# EAGLE design TSOC_GROVEY_UART (EAGLE 6.6.0)
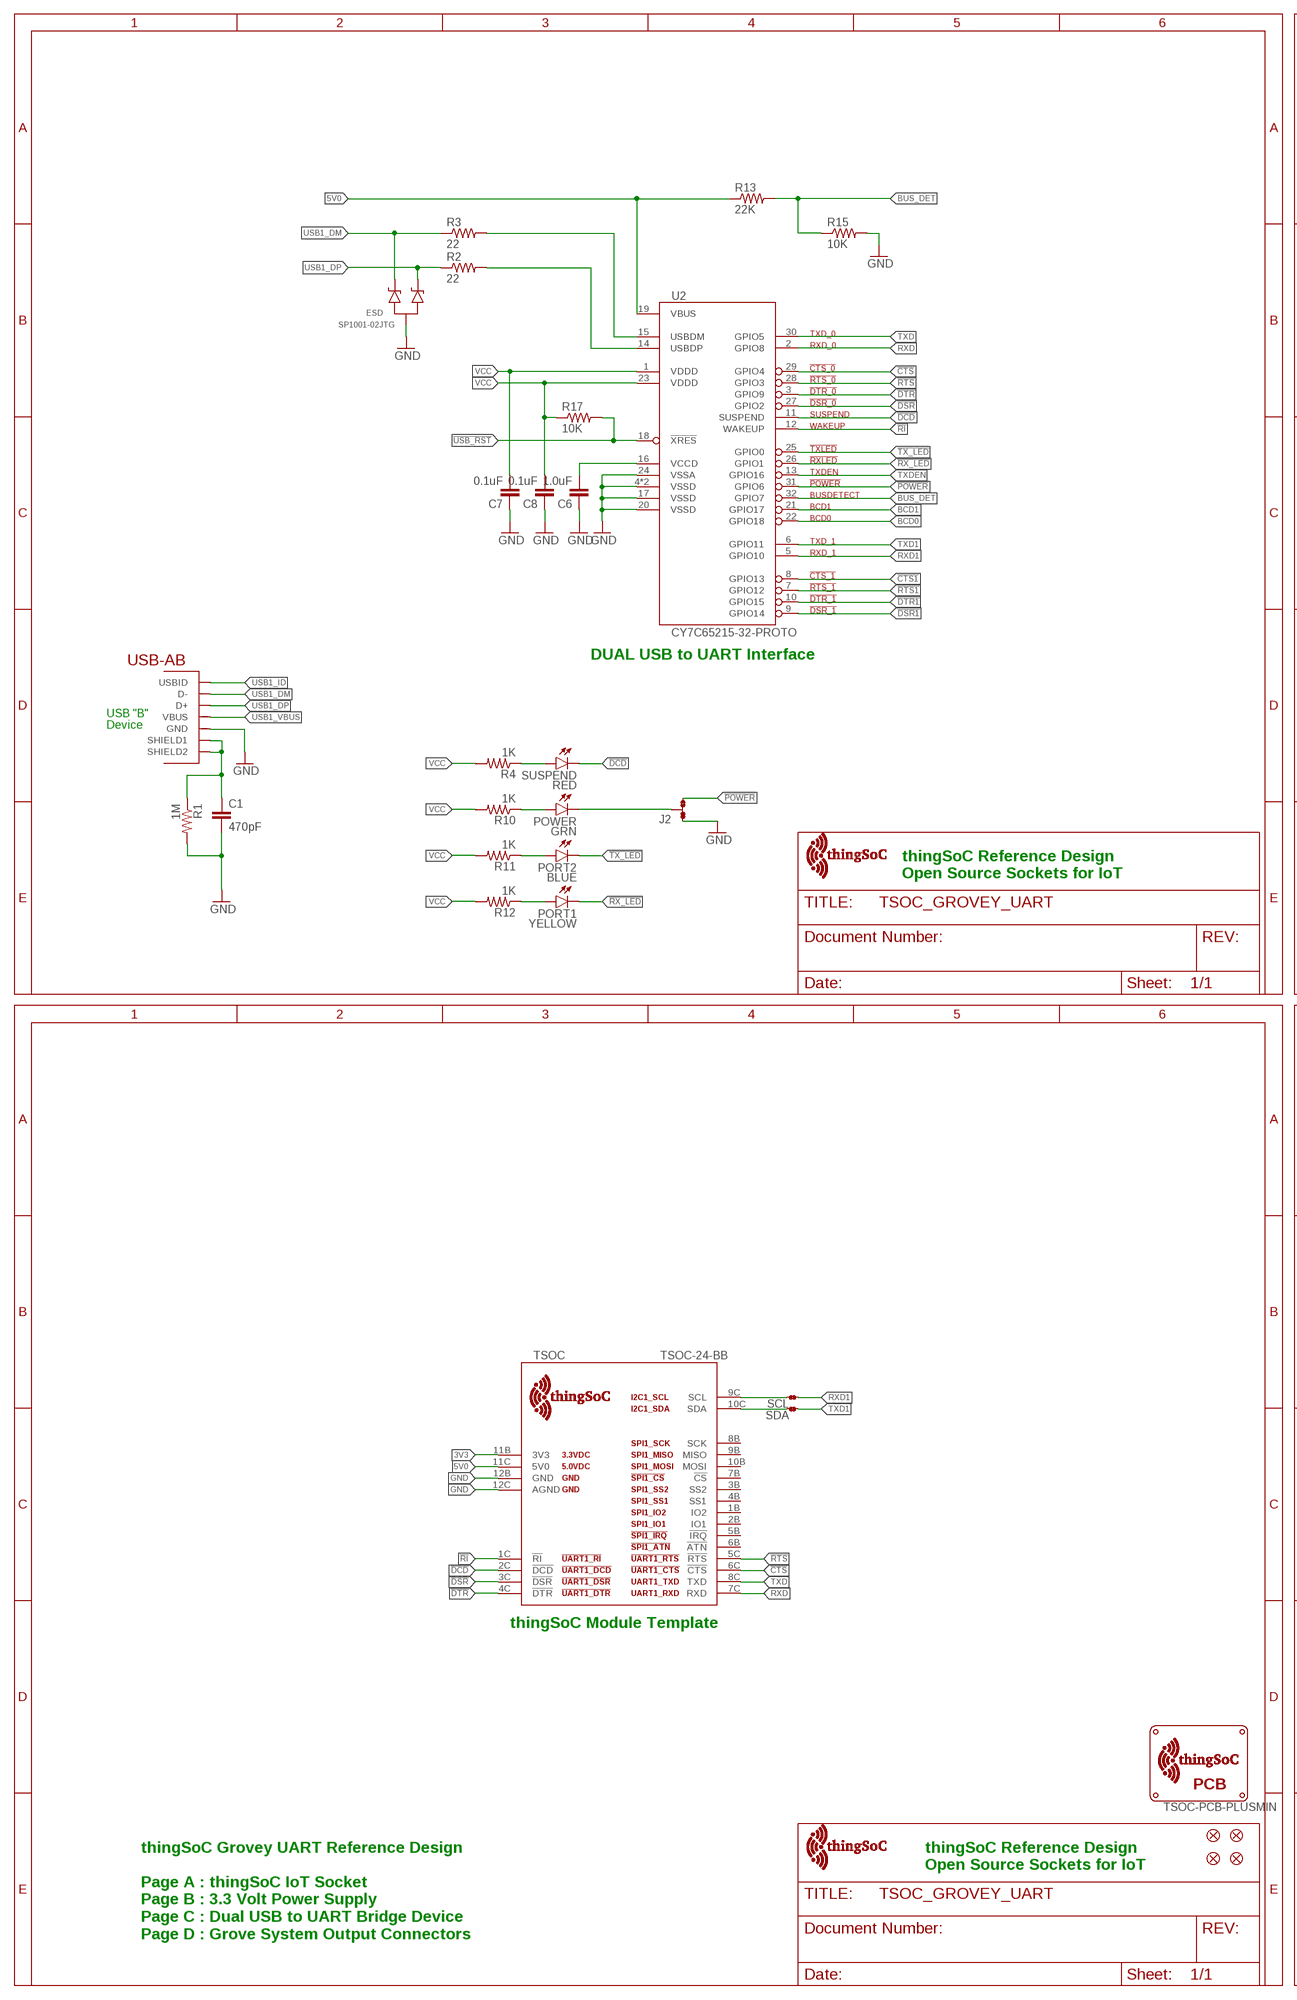
[diagram p0: schematic, sheet 1, part 1 of 2]
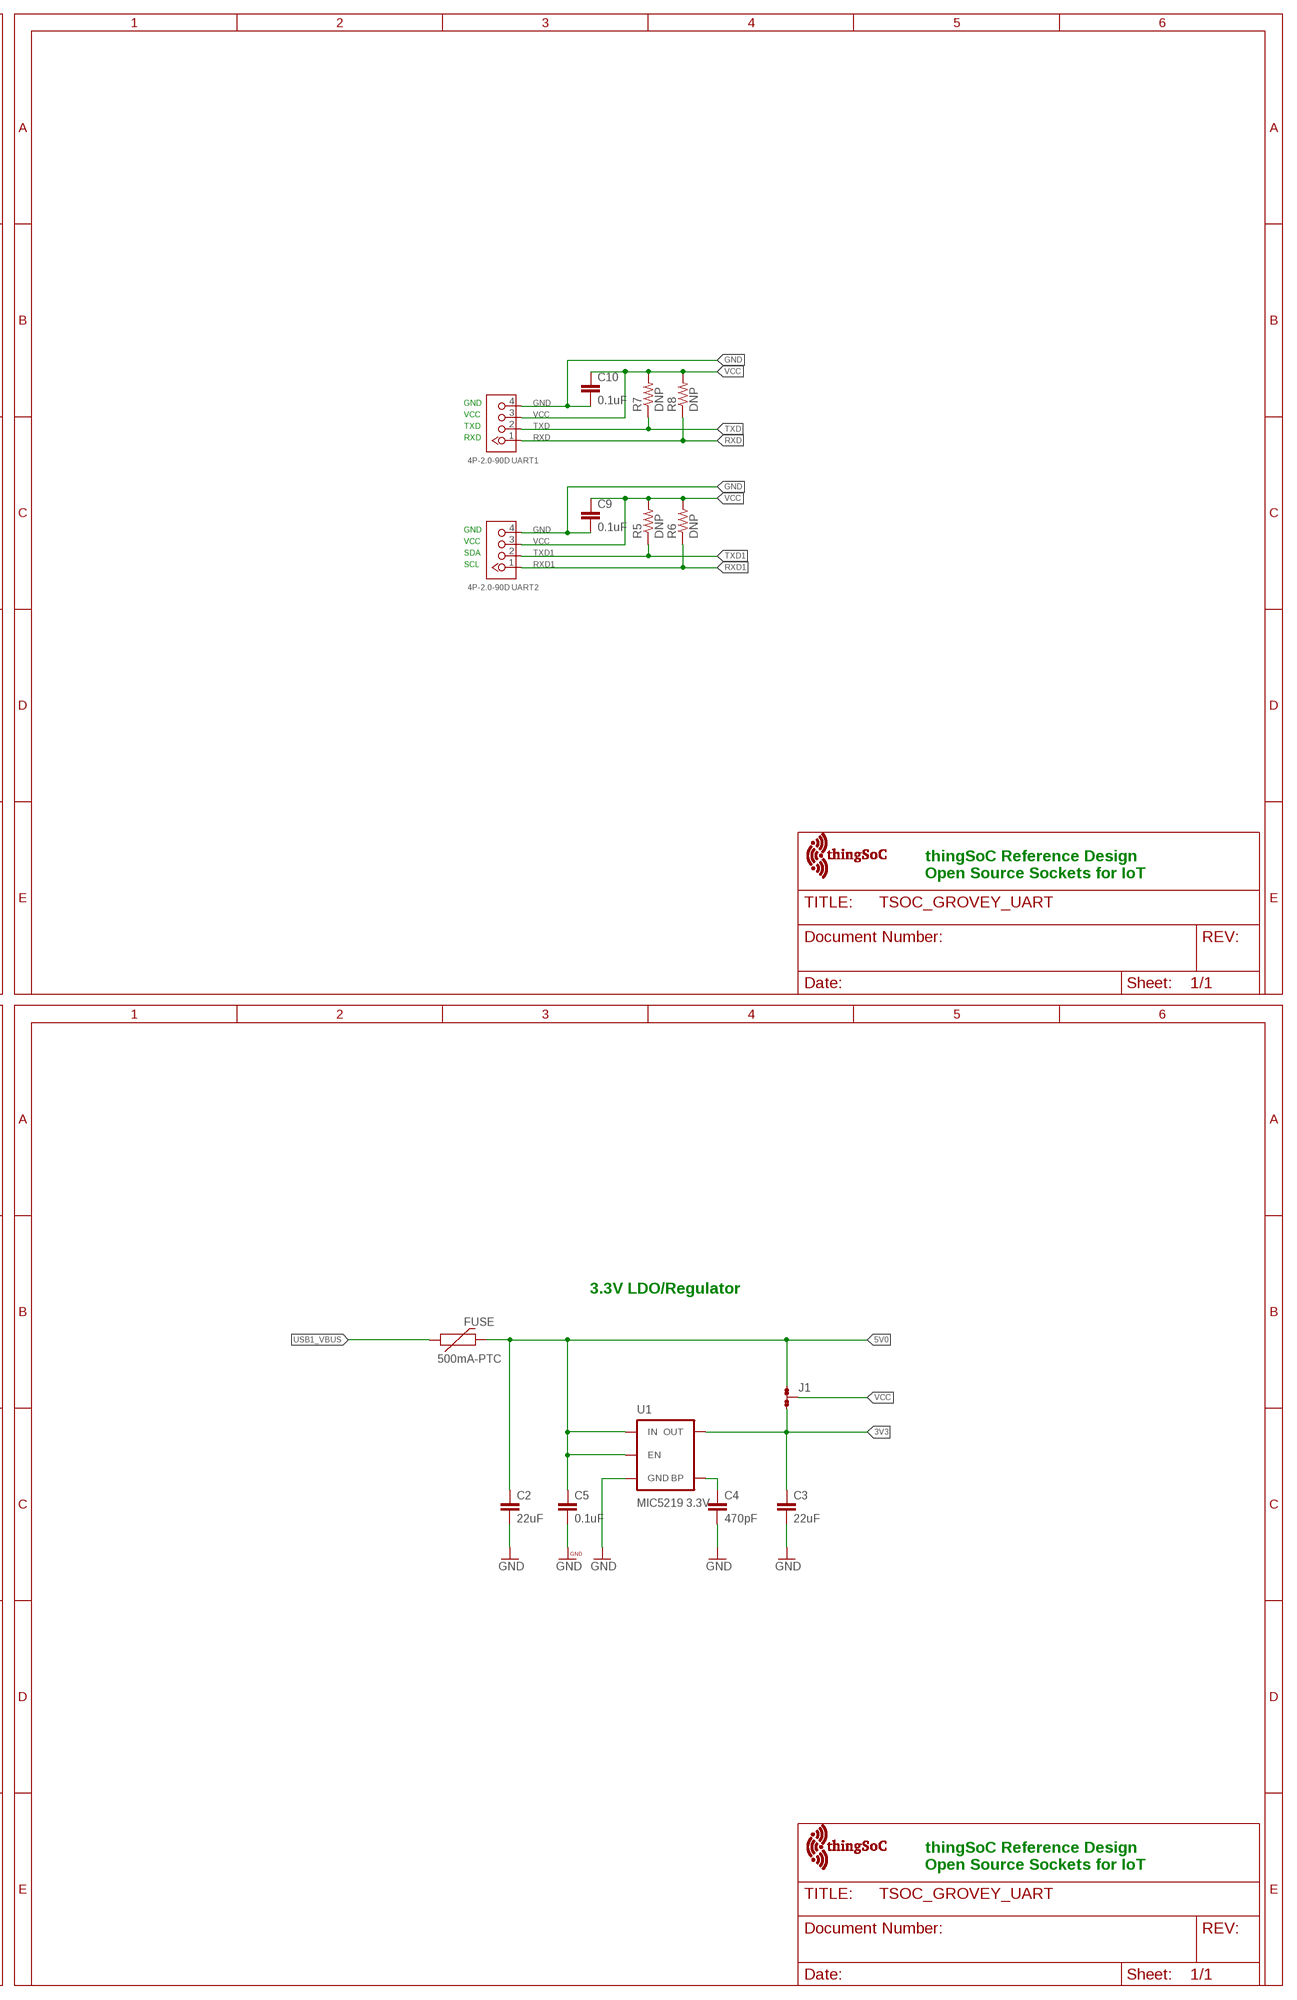
[diagram p1: schematic, sheet 1, part 2 of 2]

## Parts
C1  470pF  CAP-0603  [EIA-0603]
C2  22uF  CAP-1206  [EIA-1206]
C3  22uF  CAP-1206  [EIA-1206]
C4  470pF  CAP-0603  [EIA-0603]
C5  0.1uF  CAP-0603  [EIA-0603]
C6  1.0uF  CAP-0603  [EIA-0603]
C7  0.1uF  CAP-0603  [EIA-0603]
C8  0.1uF  CAP-0603  [EIA-0603]
C9  0.1uF  CAP0603-CAP  [0603-CAP]
C10  0.1uF  CAP0603-CAP  [0603-CAP]
ESD  SP1001-02JTG  [SC70-3]
FID1  FIDUCIALUFIDUCIAL  [MICRO-FIDUCIAL]
FID2  FIDUCIALUFIDUCIAL  [MICRO-FIDUCIAL]
FID3  FIDUCIALUFIDUCIAL  [MICRO-FIDUCIAL]
FID4  FIDUCIALUFIDUCIAL  [MICRO-FIDUCIAL]
FUSE  500mA-PTC  PTCSMD  [PTC-1206]
J1  JMP-3-1_2  [JMP-3-1_2]
J2  JMP-3-1_2  [JMP-3-1_2]
PCB  TSOC-PCB-PLUSMIN  [TSOC-BB-BRD-PLUS-MIN-DIM]
PORT1  YELLOW  LED0603  [LED-0603]
PORT2  BLUE  LED0603  [LED-0603]
POWER  GRN  LED0603  [LED-0603]
R1  1M  RESISTOR-0603  [EIA-0603]
R2  22  RESISTOR-0603  [EIA-0603]
R3  22  RESISTOR-0603  [EIA-0603]
R4  1K  RESISTOR-0603  [EIA-0603]
R5  DNP  RESISTOR0603-RES  [0603-RES]
R6  DNP  RESISTOR0603-RES  [0603-RES]
R7  DNP  RESISTOR0603-RES  [0603-RES]
R8  DNP  RESISTOR0603-RES  [0603-RES]
R10  1K  RESISTOR-0603  [EIA-0603]
R11  1K  RESISTOR-0603  [EIA-0603]
R12  1K  RESISTOR-0603  [EIA-0603]
R13  22K  RESISTOR-0603  [EIA-0603]
R15  10K  RESISTOR-0603  [EIA-0603]
R17  10K  RESISTOR-0603  [EIA-0603]
SCL  JMP-2-NO  [JMP-2-NO]
SDA  JMP-2-NO  [JMP-2-NO]
SUSPEND  RED  LED0603  [LED-0603]
TSOC  TSOC-24-BB  [TSOC-BB-S24]
U1  MIC5219 3.3V  V_REG_MIC52193.3V  [SOT23-5]
U2  CY7C65215-32-PROTO  [QFN32-PROTO]
U$3  TSOC-LOGO-LRG  [TSOC-LOGO-LRG]
U$4  TSOC-LOGO  [TSOC-LOGO-BLANK]
U$5  TSOC-LOGO  [TSOC-LOGO-BLANK]
U$6  TSOC-LOGO  [TSOC-LOGO-BLANK]
UART1  4P-2.0-90D  GROVE-CONNECTOR-DIP-90D(4P-2.0)  [HW4-2.0-90D]
UART2  4P-2.0-90D  GROVE-CONNECTOR-DIP-90D(4P-2.0)  [HW4-2.0-90D]
USB  USB_AB  [USB-AB-MICRO-SMD]

## Nets
3V3: C3.1 J1.3 TSOC.11B(3V3) U1.5(OUT)
5V0: C2.1 C5.1 FUSE.2 J1.1 R13.1 TSOC.11C(5V0) U1.1(IN) U1.3(EN) U2.19(VBUS)
!CTS: TSOC.6C(!CTS) U2.29(GPIO4)
!CTS1: U2.8(GPIO13)
!DCD: SUSPEND.C TSOC.2C(!DCD) U2.11(SUSPEND)
!DSR: TSOC.3C(!DSR) U2.27(GPIO2)
!DSR1: U2.9(GPIO14)
!DTR: TSOC.4C(!DTR) U2.3(GPIO9)
!DTR1: U2.10(GPIO15)
!POWER: J2.3 U2.31(GPIO6)
!RI: TSOC.1C(!RI) U2.12(WAKEUP)
!RTS: TSOC.5C(!RTS) U2.28(GPIO3)
!RTS1: U2.7(GPIO12)
!RX_LED: PORT1.C U2.26(GPIO1)
!TX_LED: PORT2.C U2.25(GPIO0)
!USB_RST: R17.2 U2.18(!XRES)
BCD0: U2.22(GPIO18)
BCD1: U2.21(GPIO17)
BLU: PORT2.A R11.1
BUS_DET: R13.2 R15.1 U2.32(GPIO7)
BYPASS1: C4.1 U1.4(BP)
GND [vcc]: C1.2 C2.2 C3.2 C4.2 C5.2 C6.1 C7.1 C8.1 C9.2 C10.2 ESD.3(A) J2.1 R1.2 R15.2 TSOC.12B(GND) TSOC.12C(AGND) U1.2(GND) U2.4(VSSD) U2.17(VSSD) U2.20(VSSD) U2.24(VSSA) U2.EXP(VSSD) UART1.4 UART2.4 USB.GND
GRN: POWER.A R10.1
PWR: J2.2 POWER.C
RED: R4.1 SUSPEND.A
RXD: R8.1 TSOC.7C(RXD) U2.2(GPIO8) UART1.1
RXD1: R6.1 SCL.1 U2.5(GPIO10) UART2.1
SCL: SCL.2 TSOC.9C(SCL)
SDA: SDA.2 TSOC.10C(SDA)
TXD: R7.1 TSOC.8C(TXD) U2.30(GPIO5) UART1.2
TXD1: R5.1 SDA.1 U2.6(GPIO11) UART2.2
TXDEN: U2.13(GPIO16)
USB1_DM: ESD.2(C2) R3.1 USB.D-
USB1_DP: ESD.1(C1) R2.1 USB.D+
USB1_ID: USB.ID(USBID)
USB1_M: R3.2 U2.15(USBDM)
USB1_P: R2.2 U2.14(USBDP)
USB1_SHIELD: C1.1 R1.1 USB.SHIELD1 USB.SHIELD2
USB1_VBUS: FUSE.1 USB.VBUS
VCC: C7.2 C8.2 C9.1 C10.1 J1.2 R4.2 R5.2 R6.2 R7.2 R8.2 R10.2 R11.2 R12.2 R17.1 U2.1(VDDD) U2.23(VDDD) UART1.3 UART2.3
VCCD1: C6.2 U2.16(VCCD)
YEL: PORT1.A R12.1
Unconnected: TSOC.1B(IO2) TSOC.2B(IO1) TSOC.3B(SS2) TSOC.4B(SS1) TSOC.5B(!IRQ) TSOC.6B(!ATN) TSOC.7B(!CS) TSOC.8B(SCK) TSOC.9B(MISO) TSOC.10B(MOSI)

## Notes on the sheet
- GND
- VCC
- TXD
- RXD
- GND
- VCC
- SDA
- SCL
- DUAL USB to UART Interface
- USB "B"
- Device
- thingSoC Reference Design
  Open Source Sockets for IoT
- thingSoC Reference Design
  Open Source Sockets for IoT
- 3.3V LDO/Regulator
- thingSoC Module Template
- thingSoC Reference Design
  Open Source Sockets for IoT
- thingSoC Reference Design
  Open Source Sockets for IoT
- thingSoC Grovey UART Reference Design
  
  Page A : thingSoC IoT Socket
  Page B : 3.3 Volt Power Supply
  Page C : Dual USB to UART Bridge Device
  Page D : Grove System Output Connectors

## Library data of the parts
C1-C8 = TSOC_USBUART2:CAP: Ceramic Capacitor SMD
C9 C10 = SparkFun-Passives:CAP: Capacitor Standard 0603 ceramic capacitor, and 0.1" leaded capacitor.
ESD = TSOC-ESP8266-BASE:SP1001-02JTG: Littelfuse SP1001-02JTG TVS Diode Array 8pf 15kV Source: http://www.littelfuse.com/data/en/Product_Catalogs/Littelfuse_TVS_Diode_Array_SPA_Catalog.pdf patternshed.com: created 3/25/2012
FID1-FID4 = TSOC-ESP8266-BASE:FIDUCIAL: Fiducial Alignment Points Various fiducial points for machine vision alignment.
FUSE = SparkFun:PTC: Resettable Fuse PTC Resettable Fuse. Spark Fun Electronics SKU : COM-08357
J1 J2 = PatternAgents-ProtoPads:JMP-3-1_2: Three Terminal Jumper - 1 & 2 Connected Positions 1and 2 are normally connected. PatternAgents ProtoPads Library Schematic and PCB layout libraries for design patterns by PatternAgents. For the CADSoft Eagle CAD program : http://www.cadsoftusa.com/download-eagle/ Source LBR : http://www.patternagents.com Github : https://github.com/PatternAgents License : http://creativecommons.org/licenses/by-sa/4.0/ (Creative Commons 4.0) THIS SOFTWARE IS PROVIDED BY THE CONTRIBUTORS "AS IS" AND WITHOUT ANY EXPRESS OR IMPLIED WARRANTIES, INCLUDING, BUT NOT LIMITED TO, THE IMPLIED WARRANTIES OF MERCHANTABILITY AND FITNESS FOR A PARTICULAR PURPOSE ARE DISCLAIMED. IN NO EVENT SHALL THE COPYRIGHT OWNER OR CONTRIBUTORS BE LIABLE FOR ANY DIRECT, INDIRECT, INCIDENTAL, SPECIAL, EXEMPLARY, OR CONSEQUENTIAL DAMAGES (INCLUDING, BUT NOT LIMITED TO, PROCUREMENT OF SUBSTITUTE GOODS OR SERVICES; LOSS OF USE, DATA, OR PROFITS; OR BUSINESS INTERRUPTION) HOWEVER CAUSED AND ON ANY THEORY OF LIABILITY, WHETHER IN CONTRACT, STRICT LIABILITY, OR TORT (INCLUDING NEGLIGENCE OR OTHERWISE) ARISING IN ANY WAY OUT OF THE USE OF THIS SOFTWARE, EVEN IF ADVISED OF THE POSSIBILITY OF SUCH DAMAGE.; BOM: EXCLUDE
PCB = thingSoC:TSOC-PCB: thingSoC PCB Outlines Boards Outlines for Standard Sizes (in the DImension Layer) (Registration marks in the tDocu layer - make sure to turn on tDocu/bDocu) Source LBR : http://www.thingsoc.com Github : https://github.com/thingsoc License : http://creativecommons.org/licenses/by-sa/4.0/ (Creative Commons 4.0) THIS SOFTWARE IS PROVIDED BY THE CONTRIBUTORS "AS IS" AND WITHOUT ANY EXPRESS OR IMPLIED WARRANTIES, INCLUDING, BUT NOT LIMITED TO, THE IMPLIED WARRANTIES OF MERCHANTABILITY AND FITNESS FOR A PARTICULAR PURPOSE ARE DISCLAIMED. IN NO EVENT SHALL THE COPYRIGHT OWNER OR CONTRIBUTORS BE LIABLE FOR ANY DIRECT, INDIRECT, INCIDENTAL, SPECIAL, EXEMPLARY, OR CONSEQUENTIAL DAMAGES (INCLUDING, BUT NOT LIMITED TO, PROCUREMENT OF SUBSTITUTE GOODS OR SERVICES; LOSS OF USE, DATA, OR PROFITS; OR BUSINESS INTERRUPTION) HOWEVER CAUSED AND ON ANY THEORY OF LIABILITY, WHETHER IN CONTRACT, STRICT LIABILITY, OR TORT (INCLUDING NEGLIGENCE OR OTHERWISE) ARISING IN ANY WAY OUT OF THE USE OF THIS SOFTWARE, EVEN IF ADVISED OF THE POSSIBILITY OF SUCH DAMAGE.
PORT1 PORT2 POWER SUSPEND = TSOC-ESP8266-BASE:LED: LEDs Standard schematic elements and footprints for 5mm, 3mm, 1206, and 0603 sized LEDs. 5mm - Spark Fun Electronics SKU : COM-00529 (and others)
R1-R4 R10-R13 R15 R17 = TSOC_USBUART2:RESISTOR
R5-R8 = SparkFun-Passives:RESISTOR: Resistor Basic schematic elements and footprints for 0603, 1206, and PTH resistors.
SCL SDA = PatternAgents-ProtoPads:JMP-2-NO: Two Terminal Jumper - Normally Open Positions 1 and 2 are normally NOT connected. PatternAgents ProtoPads Library Schematic and PCB layout libraries for design patterns by PatternAgents. For the CADSoft Eagle CAD program : http://www.cadsoftusa.com/download-eagle/ Source LBR : http://www.patternagents.com Github : https://github.com/PatternAgents License : http://creativecommons.org/licenses/by-sa/4.0/ (Creative Commons 4.0) THIS SOFTWARE IS PROVIDED BY THE CONTRIBUTORS "AS IS" AND WITHOUT ANY EXPRESS OR IMPLIED WARRANTIES, INCLUDING, BUT NOT LIMITED TO, THE IMPLIED WARRANTIES OF MERCHANTABILITY AND FITNESS FOR A PARTICULAR PURPOSE ARE DISCLAIMED. IN NO EVENT SHALL THE COPYRIGHT OWNER OR CONTRIBUTORS BE LIABLE FOR ANY DIRECT, INDIRECT, INCIDENTAL, SPECIAL, EXEMPLARY, OR CONSEQUENTIAL DAMAGES (INCLUDING, BUT NOT LIMITED TO, PROCUREMENT OF SUBSTITUTE GOODS OR SERVICES; LOSS OF USE, DATA, OR PROFITS; OR BUSINESS INTERRUPTION) HOWEVER CAUSED AND ON ANY THEORY OF LIABILITY, WHETHER IN CONTRACT, STRICT LIABILITY, OR TORT (INCLUDING NEGLIGENCE OR OTHERWISE) ARISING IN ANY WAY OUT OF THE USE OF THIS SOFTWARE, EVEN IF ADVISED OF THE POSSIBILITY OF SUCH DAMAGE.; BOM: EXCLUDE
TSOC = thingSoC:TSOC-24: thingSoC Twenty-Four(24) Pin Socket Source LBR : http://www.thingsoc.com Github : https://github.com/thingsoc License : http://creativecommons.org/licenses/by-sa/4.0/ (Creative Commons 4.0) THIS SOFTWARE IS PROVIDED BY THE CONTRIBUTORS "AS IS" AND WITHOUT ANY EXPRESS OR IMPLIED WARRANTIES, INCLUDING, BUT NOT LIMITED TO, THE IMPLIED WARRANTIES OF MERCHANTABILITY AND FITNESS FOR A PARTICULAR PURPOSE ARE DISCLAIMED. IN NO EVENT SHALL THE COPYRIGHT OWNER OR CONTRIBUTORS BE LIABLE FOR ANY DIRECT, INDIRECT, INCIDENTAL, SPECIAL, EXEMPLARY, OR CONSEQUENTIAL DAMAGES (INCLUDING, BUT NOT LIMITED TO, PROCUREMENT OF SUBSTITUTE GOODS OR SERVICES; LOSS OF USE, DATA, OR PROFITS; OR BUSINESS INTERRUPTION) HOWEVER CAUSED AND ON ANY THEORY OF LIABILITY, WHETHER IN CONTRACT, STRICT LIABILITY, OR TORT (INCLUDING NEGLIGENCE OR OTHERWISE) ARISING IN ANY WAY OUT OF THE USE OF THIS SOFTWARE, EVEN IF ADVISED OF THE POSSIBILITY OF SUCH DAMAGE.
U1 = TSOC-ESP8266-BASE:V_REG_MIC5219: V_REG MIC5219 Standard 3.3V and 5V 500mA LDO voltage regulator in SOT-23 layout. Micrel part MIC5219. BP (by-pass) pin is used to lower output noise with 470pF cap, may be left open.; PROD_ID: VREG-09872
U2 = PatternAgents-Cypress:CY7C65215-32: Cypress EZ-USB ® CY7C65215-32QFN DUAL CHANNEL USB TO UART/SPI/IC Bridge Full-Speed USB Peripheral Controller Source Data: http://www.cypress.com/?mpn=CY7C65211-24QFN LBR Source: http://www.patternagents.com THIS SOFTWARE IS PROVIDED BY THE CONTRIBUTORS "AS IS" AND WITHOUT ANY EXPRESS OR IMPLIED WARRANTIES, INCLUDING, BUT NOT LIMITED TO, THE IMPLIED WARRANTIES OF MERCHANTABILITY AND FITNESS FOR A PARTICULAR PURPOSE ARE DISCLAIMED. IN NO EVENT SHALL THE COPYRIGHT OWNER OR CONTRIBUTORS BE LIABLE FOR ANY DIRECT, INDIRECT, INCIDENTAL, SPECIAL, EXEMPLARY, OR CONSEQUENTIAL DAMAGES (INCLUDING, BUT NOT LIMITED TO, PROCUREMENT OF SUBSTITUTE GOODS OR SERVICES; LOSS OF USE, DATA, OR PROFITS; OR BUSINESS INTERRUPTION) HOWEVER CAUSED AND ON ANY THEORY OF LIABILITY, WHETHER IN CONTRACT, STRICT LIABILITY, OR TORT (INCLUDING NEGLIGENCE OR OTHERWISE) ARISING IN ANY WAY OUT OF THE USE OF THIS SOFTWARE, EVEN IF ADVISED OF THE POSSIBILITY OF SUCH DAMAGE.
U$3-U$6 = thingSoC:TSOC-LOGO: thingSoC Logo Source LBR : http://www.thingsoc.com Github : https://github.com/thingsoc License : http://creativecommons.org/licenses/by-sa/4.0/ (Creative Commons 4.0) THIS SOFTWARE IS PROVIDED BY THE CONTRIBUTORS "AS IS" AND WITHOUT ANY EXPRESS OR IMPLIED WARRANTIES, INCLUDING, BUT NOT LIMITED TO, THE IMPLIED WARRANTIES OF MERCHANTABILITY AND FITNESS FOR A PARTICULAR PURPOSE ARE DISCLAIMED. IN NO EVENT SHALL THE COPYRIGHT OWNER OR CONTRIBUTORS BE LIABLE FOR ANY DIRECT, INDIRECT, INCIDENTAL, SPECIAL, EXEMPLARY, OR CONSEQUENTIAL DAMAGES (INCLUDING, BUT NOT LIMITED TO, PROCUREMENT OF SUBSTITUTE GOODS OR SERVICES; LOSS OF USE, DATA, OR PROFITS; OR BUSINESS INTERRUPTION) HOWEVER CAUSED AND ON ANY THEORY OF LIABILITY, WHETHER IN CONTRACT, STRICT LIABILITY, OR TORT (INCLUDING NEGLIGENCE OR OTHERWISE) ARISING IN ANY WAY OUT OF THE USE OF THIS SOFTWARE, EVEN IF ADVISED OF THE POSSIBILITY OF SUCH DAMAGE.
UART1 UART2 = Seeed-Connector -2016:GROVE-CONNECTOR-DIP-90D(4P-2.0): 320110034
USB = BeeSafe:USB_AB: This is a USB AB connector that is compatible with USB OTG. i.e. this connector can serve as a host or device

## Net classes
1 vcc: width 0.254 mm

## Board
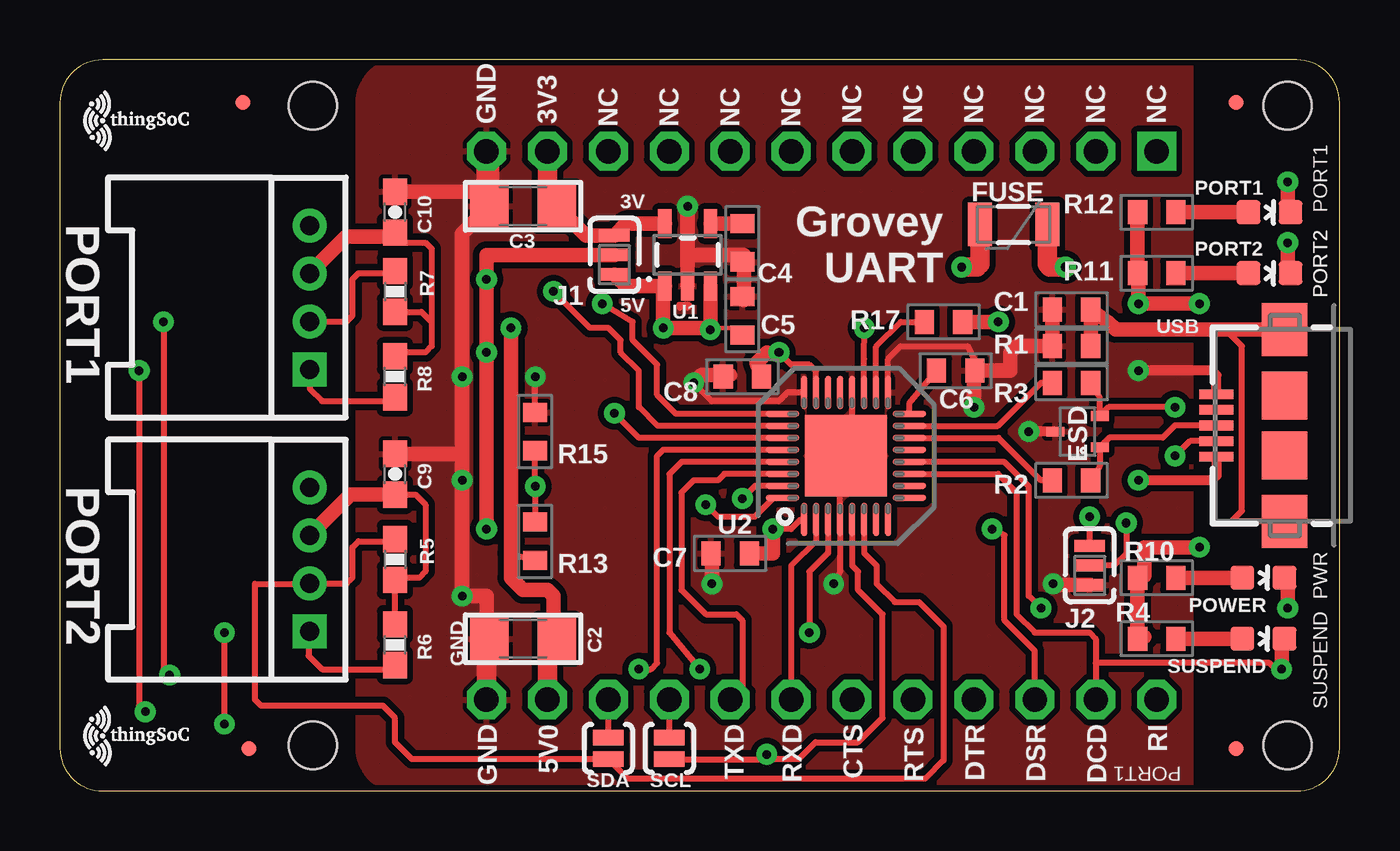
[diagram p2: board, top side]
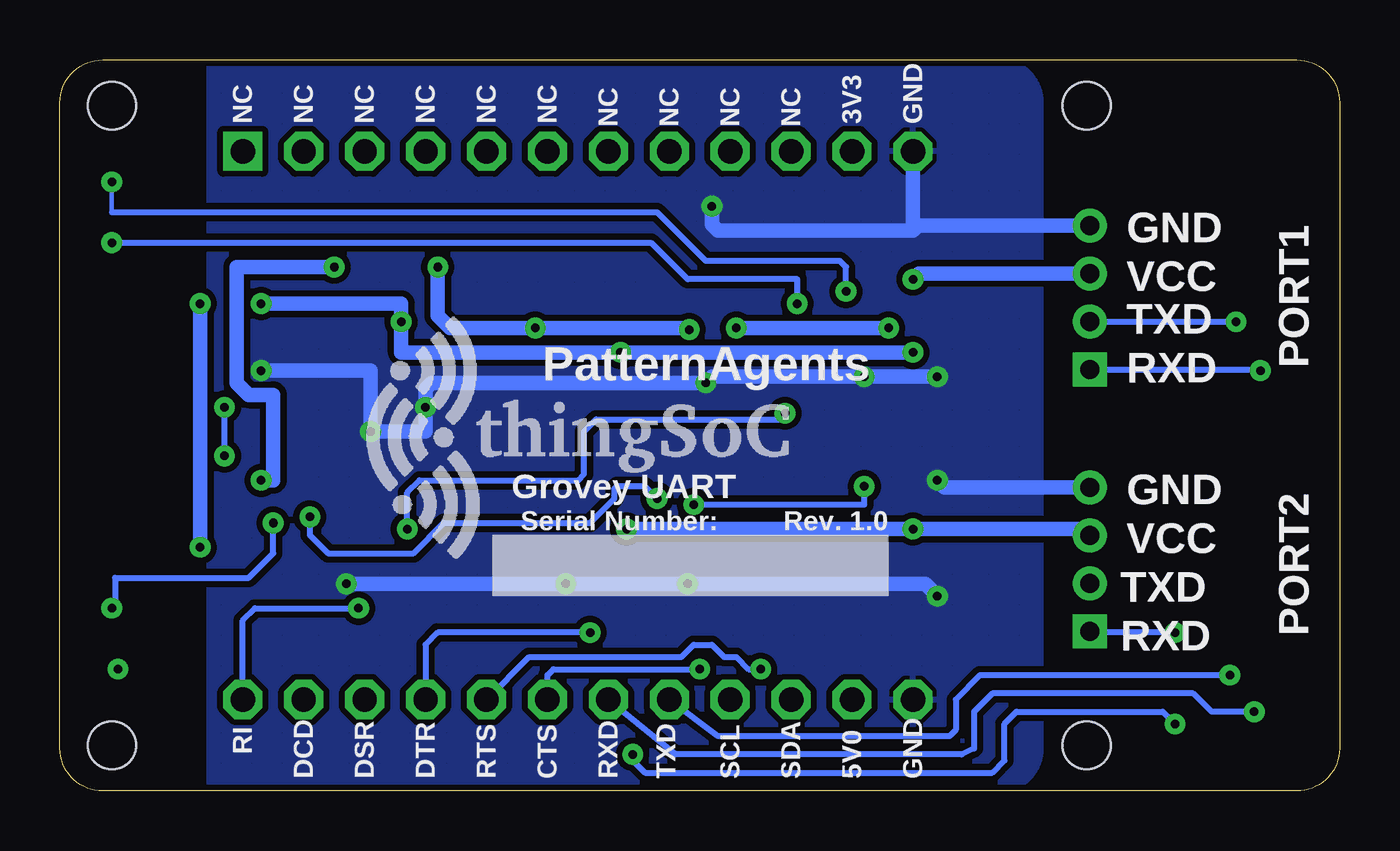
[diagram p3: board, bottom side, seen from below]

Size 53.34 x 30.48 mm. Coordinates in mm from the lower left corner, seen from the top.
Copper layers (1*16): Top 0.035mm / dielectric 1.5mm / Bottom 0.035mm
Design rules "PatternAgents_7mil": minimum track width 7mil, minimum drill 14mil, track to track 7mil, track to pad 7mil, pad to pad 7mil, via to via 7mil, smd to smd 7mil, copper to edge 7mil, drill to drill 7mil, minimum pad ring 12mil, minimum via ring 10mil, stop-mask expansion 4mil, vias tented up to drill 25mil, thermal gap 7mil

### Footprints (pad centres in the part's own frame; a part is rotated, then mirrored left to right if it is on the bottom)
EIA-0603 = smd 0.8 x 1: 1 -0.8,0; 2 0.8,0
EIA-1206 = smd 1.6 x 1.8: 1 -1.4,0; 2 1.4,0
0603-CAP = smd 1.1 x 1: 1 -0.85,0; 2 0.85,0
SC70-3 = smd 0.4 x 0.75: 1 -0.65,-0.925; 2 0.65,-0.925; 3 0,0.925
MICRO-FIDUCIAL = smd 0.635 x 0.635: 1 0,0
PTC-1206 = smd 1 x 1.8: 1 -1.4,0; 2 1.4,0
JMP-3-1_2 = smd 0.508 x 1.27: 1 -0.813,0; 2 0,0; 3 0.813,0
TSOC-BB-BRD-PLUS-MIN-DIM = hole 2: -13.335,-23.749; 13.335,-23.749; -13.335,16.891; 13.335,16.891
LED-0603 = smd 1 x 1: A 0,-0.877; C 0,0.877
0603-RES = smd 1.1 x 1: 1 -0.85,0; 2 0.85,0
JMP-2-NO = smd 0.635 x 1.27: 1 -0.45,0; 2 0.45,0
TSOC-BB-S24 = drill 1.016 square: 1B -11.43,11.43 | drill 1.016 octagon: 1C 11.43,11.43; 2B -11.43,8.89; 2C 11.43,8.89; 3B -11.43,6.35; 3C 11.43,6.35; 4B -11.43,3.81; 4C 11.43,3.81; 5B -11.43,1.27; 5C 11.43,1.27; 6B -11.43,-1.27; 6C 11.43,-1.27; 7B -11.43,-3.81; 7C 11.43,-3.81; 8B -11.43,-6.35; 8C 11.43,-6.35; 9B -11.43,-8.89; 9C 11.43,-8.89; 10B -11.43,-11.43; 10C 11.43,-11.43; 11B -11.43,-13.97; 11C 11.43,-13.97; 12B -11.43,-16.51; 12C 11.43,-16.51
SOT23-5 = smd 0.55 x 1.2: 1 -0.95,-1.3; 2 0,-1.3; 3 0.95,-1.3; 4 0.95,1.3; 5 -0.95,1.3
QFN32-PROTO = smd 1.4 x 0.254: 1 -2.65,1.75; 2 -2.65,1.25; 3 -2.65,0.75; 4 -2.65,0.25; 5 -2.65,-0.25; 6 -2.65,-0.75; 7 -2.65,-1.25; 8 -2.65,-1.75; 17 2.65,-1.75; 18 2.65,-1.25; 19 2.65,-0.75; 20 2.65,-0.25; 21 2.65,0.25; 22 2.65,0.75; 23 2.65,1.25; 24 2.65,1.75 | smd 0.254 x 1.4: 9 -1.75,-2.65; 10 -1.25,-2.65; 11 -0.75,-2.65; 12 -0.25,-2.65; 13 0.25,-2.65; 14 0.75,-2.65; 15 1.25,-2.65; 16 1.75,-2.65; 25 1.75,2.65; 26 1.25,2.65; 27 0.75,2.65; 28 0.25,2.65; 29 -0.25,2.65; 30 -0.75,2.65; 31 -1.25,2.65; 32 -1.75,2.65 | smd 3.4 x 3.4: EXP 0,0
HW4-2.0-90D = drill 0.8 pad 1.27 square: 1 -3,0 | drill 0.8 pad 1.27: 2 -1,0; 3 1,0; 4 3,0
USB-AB-MICRO-SMD = smd 1.4 x 0.4: D+ 2.85,0; D- 2.85,0.65; GND 2.85,-1.3; ID 2.85,-0.65; VBUS 2.85,1.3 | smd 1.9 x 2: P$6 0,1.25; P$7 0,-1.25 | smd 1.9 x 2.2: SHIELD1 0,4; SHIELD2 0,-4

### Placement (x,y rotation side)
C1  42.16,20.07 180 top
C2  19.3,6.35 180 top
C3  19.3,24.38 180 top
C4  28.45,22.86 270 top
C5  28.45,19.81 90 top
C6  37.34,17.53 180 top
C7  27.94,9.91 0 top
C8  28.45,17.27 0 top
C9  13.97,13.21 90 top
C10  13.97,24.13 90 top
ESD  42.42,14.99 90 top
FID1  49.02,1.78 180 top
FID2  49.02,28.7 180 top
FID3  7.62,28.7 180 top
FID4  7.87,1.78 180 top
FUSE  39.75,23.62 180 top
J1  23.11,22.35 90 top
J2  42.93,9.4 90 top
PCB  34.29,15.24 270 top
PORT1  50.42,24.13 270 top
PORT2  50.42,21.59 270 top
POWER  50.16,8.89 270 top
R1  42.16,18.54 180 top
R2  42.16,12.95 180 top
R3  42.16,17.02 180 top
R4  45.72,6.35 180 top
R5  13.97,9.65 270 top
R6  13.97,6.1 90 top
R7  13.97,20.83 270 top
R8  13.97,17.27 90 top
R10  45.72,8.89 180 top
R11  45.72,21.59 180 top
R12  45.72,24.13 180 top
R13  19.81,10.41 90 top
R15  19.81,14.99 90 top
R17  36.83,19.56 180 top
SCL  25.4,1.78 90 top
SDA  22.86,1.78 90 top
SUSPEND  50.16,6.35 270 top
TSOC  34.29,15.24 270 top
U1  26.16,22.35 0 top
U2  32.77,13.97 90 top
U$1  TSOC-LOGO-SMALL  [TSOC-LOGO-SML]  1.78,27.94 0 top
U$3  37.34,14.73 0 bottom
U$4  49.53,28.7 180 top
U$5  49.53,28.7 180 top
U$6  49.53,28.7 180 top
U$7  TSOC-LOGO-SMALL  [TSOC-LOGO-SML]  1.78,2.29 0 top
UART1  10.41,20.57 90 top
UART2  10.41,9.65 90 top
USB  51.05,15.24 180 top

### Tracks (layer width: path | path; a pad name or v marks a point on that pad's centre or on a via)
3V3
  Top 0.61: U1.5 23.6,23.65 J1.3 21.92,23.16 C3.1
  Top 0.813: TSOC.11B 20.32,24.77 C3.1
5V0  (via drill 0.36)
  Top 0.178: C5.1 28.45,19.3 27.43,19.3 v27.11,19.24
  Top 0.254: R13.1 18.87,9.83 18.8,9.91 | U2.19 33.52,18.02 v33.53,19.3
  Top 0.61: J1.1 23.6,21.05 U1.1 25.15,20.99 v25.15,19.3 27.18,19.3 v27.11,19.24 | v27.11,19.24 U1.3 | v18.8,19.3 18.8,9.91 18.8,8.89 19.3,8.38 20.32,8.38 20.57,8.13 20.57,6.48 C2.1 20.6,6.24 20.32,6.24 | v27.12,19.23 v27.11,19.24
  Top 0.813: 20.32,6.24 TSOC.11C | FUSE.2 38.35,21.97 38.23,21.84 v37.59,21.84
  Bottom 0.61: v25.15,19.3 v18.8,19.3 | v27.11,19.24 27.18,19.3 v33.53,19.3 37.08,19.3 37.59,19.81 v37.59,21.84
!CTS  (via drill 0.36)
  Top 0.254: U2.29 25.91,13.72 25.4,13.21 25.4,6.6 v26.67,5.08
  Bottom 0.254: TSOC.6C 33.02,4.83 32.77,5.08 v26.67,5.08
!DCD  (via drill 0.36)
  Top 0.254: v50.93,5.08 50.67,5.08 50.42,5.33 43.18,5.33 | 43.18,5.33 TSOC.2C | U2.11 39.1,13.22 39.88,12.45 39.88,7.37 40.64,6.6 42.93,6.6 43.18,6.35 43.18,5.33
  Top 0.61: SUSPEND.C 50.93,6.35 v50.93,5.08
!DSR  (via drill 0.36)
  Top 0.254: TSOC.3C 40.64,5.84 39.37,7.11 39.37,10.67 v38.86,10.92 | v23.11,15.75 24.14,14.72 U2.27
  Bottom 0.254: v38.86,10.92 38.86,12.45 38.35,12.95 31.75,12.95 31.5,13.21 31.5,14.99 30.99,15.49 23.37,15.49 v23.11,15.75
!DTR  (via drill 0.36)
  Top 0.254: U2.3 32.02,9.92 31.24,9.14 v31.24,6.6
  Bottom 0.254: v31.24,6.6 37.59,6.6 38.1,6.1 TSOC.4C
!POWER  (via drill 0.36)
  Top 0.254: J2.3 v42.93,11.43 | U2.31 28.98,12.72 v28.45,12.19
  Bottom 0.254: v42.93,11.43 42.93,10.67 42.16,9.91 38.61,9.91 37.34,11.18 31.24,11.18 30.23,12.19 30.23,12.61 U2.31 28.98,12.72 v28.45,12.19
!RI  (via drill 0.36)
  Top 0.254: U2.12 39.37,13.72 40.39,12.7 40.39,8.13 v40.89,7.62
  Bottom 0.254: TSOC.1C 45.72,7.11 45.21,7.62 v40.89,7.62
!RTS  (via drill 0.36)
  Top 0.254: U2.28 25.15,14.22 24.89,13.97 24.89,5.33 24.64,5.08 v24.13,5.08
  Bottom 0.254: TSOC.5C 33.78,5.59 27.43,5.59 26.92,6.1 26.16,6.1 25.65,5.59 25.15,5.59 24.64,5.08 v24.13,5.08
!RX_LED  (via drill 0.36)
  Top 0.254: U2.26 24.91,15.22 24.13,16 24.13,17.53 23.37,18.29 23.37,18.8 22.86,19.3 22.1,19.3 v20.57,20.83
  Top 0.61: PORT1.C 51.18,24.13 v51.18,25.4
  Bottom 0.178: v51.18,25.4 51.18,24.13
  Bottom 0.254: 51.18,24.13 28.45,24.13 26.42,22.1 20.83,22.1 20.57,21.84 v20.57,20.83
!TX_LED  (via drill 0.36)
  Top 0.254: U2.25 25.68,15.72 24.89,16.51 24.89,17.78 23.88,18.8 23.88,19.56 v22.61,20.32
  Top 0.61: PORT2.C 51.18,21.59 v51.18,22.86
  Bottom 0.254: v51.18,22.86 28.7,22.86 27.18,21.34 22.61,21.34 v22.61,20.32
!USB_RST
  Top 0.254: U2.18 34.02,18.52 35.05,19.56 R17.2
BLU
  Top 0.61: R11.1 PORT2.A
BUS_DET  (via drill 0.36)
  Top 0.254: R13.2 v19.81,12.7 R15.1 | U2.32 29.75,12.22 28.96,11.43 27.43,11.43 v26.92,11.94
  Bottom 0.254: v26.92,11.94 19.81,11.94 v19.81,12.7
BYPASS1
  Top 0.61: U1.4 28.24,23.65 C4.1
GND  (via drill 0.36)
  Top 0.254: v32.26,8.64 32.52,9.14 U2.4 32.52,13.72 U2.EXP 33.02,14.22 U2.20 | 27.94,17.2 C8.1 | U2.24 30.34,16.62 29.97,16.26 27.18,16.26 v26.42,17.02 | R15.2 v19.81,17.27 | 38.1,17.45 C6.1 38.1,17.31 38.1,18.03 37.85,18.54 35.05,18.54 34.52,18.01 U2.17 | U1.2 26.24,20.95 26.06,20.95 U1.2 | 26.24,20.24 26.16,20.24 | 26.16,20.24 26.15,20.24 | U1.2 26.24,21.13 U1.2 26.19,21.06 U1.2 | 17.83,24.97 C3.2 | C3.2 18.01,24.43 18.03,24.51 | C3.2 17.83,24.43 17.83,24.51 | 17.83,24.79 C3.2 | 17.83,24.61 C3.2 | 17.48,24.61 17.48,24.89 17.48,26.21 17.65,26.39 | 17.65,26.21 TSOC.12B | 17.65,26.21 | 17.65,26.39 TSOC.12B | 17.65,26.39 | 16.74,22.84 16.76,22.86 | 18.01,25.32 17.9,25.32 | 17.83,25.68 17.9,25.68 17.96,25.78 17.91,25.78 | 17.83,26.39 TSOC.12B | TSOC.12B 18.01,26.39 17.91,26.39 | 25.83,20.15 25.83,20.17 25.81,20.27 26.16,20.27 26.16,20.24 | U1.2 26.19,20.88 26.15,20.88 | 26.19,20.17 26.15,20.15 | TSOC.12B 17.6,26.49 17.65,26.49 | 17.78,24.54 C3.2 | 17.78,24.71 C3.2
  Top 0.406: ESD.3 v40.39,14.99 | USB.GND 48.2,17.33 48.01,17.53 v44.96,17.53
  Top 0.61: C1.2 R1.2 39.88,18.54 39.62,18.29 39.62,17.53 C6.1 38.1,17.23 v38.1,16 | 16.76,14.22 v16.76,12.95 v16.76,8.13 17.78,8.13 17.78,6.47 C2.2 | 16.76,14.22 v16.76,17.27 16.76,22.86 16.76,23.24 C3.2 | C8.1 27.94,17.34 26.74,17.34 v26.42,17.02 | C5.2 28.52,20.46 28.52,22.35 C4.2 28.38,22.35 26.16,22.35 | J2.1 41.45,8.59 v41.4,8.64 | U1.2 26.16,22.35 | 26.16,22.35 v26.16,24.38 | C7.1 27.18,9.91 v27.18,8.64 | C10.2 17.39,24.98 17.48,24.89 | C9.2 16.6,14.06 16.76,14.22
  Top 0.813: 17.8,26.65 TSOC.12B 17.9,26.55 17.9,25.68 17.9,25.32 C3.2 | 17.78,6.35 TSOC.12C
  Bottom 0.61: v16.76,17.27 v19.81,17.27 26.16,17.27 v26.42,17.02 37.85,17.02 38.1,16.76 v38.1,16 38.1,14.99 v40.39,14.99 40.39,17.53 v44.96,17.53 | v16.76,8.13 17.27,8.64 v27.18,8.64 v32.26,8.64 v41.4,8.64 | TSOC.12B 17.78,23.37 | 17.78,23.37 25.91,23.37 26.16,23.62 v26.16,24.38 | UART1.4 17.57,23.57 17.78,23.37 | UART2.4 16.46,12.65 v16.76,12.95
  pour Top (isolate 0.254, hatched): 47.12,0 14.25,0 arc-90 12.45,1.81 12.45,28.67 arc-90 14.25,30.48 47.12,30.48
  pour Bottom (isolate 0.254, hatched): 47.12,0 14.24,0 arc-90 12.45,1.8 12.45,28.67 arc-90 14.25,30.48 47.12,30.48
GRN
  Top 0.61: R10.1 POWER.A
PWR  (via drill 0.36)
  Top 0.254: v44.45,11.18 44.45,9.91 43.94,9.4 J2.2
  Top 0.61: v51.18,7.62 51.18,8.75 POWER.C
  Bottom 0.254: v51.18,7.62 51.04,7.76 POWER.C 45.47,8.89 44.45,9.91 v44.45,11.18
RED
  Top 0.61: R4.1 SUSPEND.A
RXD  (via drill 0.36)
  Top 0.254: U2.2 31.52,10.43 30.48,9.4 TSOC.7C | v3.3,17.53 3.3,3.56 v3.56,3.3 | UART1.1 10.41,16.76 10.92,16.26 13.8,16.26 R8.1
  Bottom 0.254: UART1.1 3.35,17.57 v3.3,17.53 | v3.56,3.3 5.33,3.3 6.1,4.06 14.48,4.06 15.24,3.3 15.24,1.78 15.75,1.52 27.69,1.52 TSOC.7C
RXD1  (via drill 0.36)
  Top 0.178: 10.37,6.58 10.34,6.58 UART2.1
  Top 0.254: U2.5 33.02,9.4 33.27,9.14 33.27,8.38 34.29,7.37 34.29,3.05 33.27,2.03 31.5,2.03 30.79,1.33 29.66,1.33 v29.46,1.52 29.27,1.33 SCL.1 | 10.37,6.6 10.37,6.58 10.37,5.64 10.92,5.08 13.8,5.08 R6.1 | v6.86,2.79 v6.86,6.6
  Bottom 0.254: v29.46,1.52 29.46,1.27 28.96,0.76 14.48,0.76 13.97,1.27 13.97,2.79 13.46,3.3 7.37,3.3 v6.86,2.79 | v6.86,6.6 10.37,6.6 UART2.1
SCL
  Top 0.254: SCL.2 TSOC.9C
SDA
  Top 0.254: SDA.2 TSOC.10C
TXD  (via drill 0.36)
  Top 0.254: U2.30 27.7,13.22 27.43,12.95 26.42,12.95 25.91,12.45 25.91,8.38 26.92,7.37 28.19,7.37 28.45,7.11 28.45,4.32 TSOC.8C | v4.32,19.56 4.32,5.08 v4.57,4.83 | UART1.2 11.95,19.57 12.19,19.81 12.19,21.34 12.45,21.59 13.88,21.59 R7.1
  Bottom 0.254: UART1.2 4.33,19.57 v4.32,19.56 | v4.57,4.83 14.99,4.83 16,3.81 16,2.54 16.26,2.29 25.91,2.29 TSOC.8C
TXD1
  Top 0.254: U2.6 33.52,9.92 34.04,9.4 34.04,8.64 34.8,7.87 35.81,7.87 36.83,6.86 36.83,1.27 36.07,0.51 23.68,0.51 SDA.1 14.67,1.33 13.97,2.03 13.97,3.05 13.46,3.56 8.38,3.56 8.13,3.81 8.13,8.64 10.4,8.64 UART2.2 11.95,8.65 12.19,8.89 12.19,10.16 12.45,10.41 13.88,10.41 R5.1
USB1_DM  (via drill 0.36)
  Top 0.254: ESD.2 43.34,16.42 R3.1 | USB.D- 47.1,14.59 v46.48,13.97 | 43.45,15.75 ESD.2 | v46.48,16 43.71,16 ESD.2
  Bottom 0.254: v46.48,13.97 v46.48,16
USB1_DP
  Top 0.254: ESD.1 43.34,13.55 R2.1 | 43.23,14.22 ESD.1 | USB.D+ 46.48,15.24 45.97,14.73 43.74,14.73 ESD.1
USB1_M
  Top 0.254: U2.15 39.1,15.22 40.89,17.02 R3.2
USB1_P
  Top 0.254: U2.14 39.13,14.72 40.89,12.95 R2.2
USB1_SHIELD
  Top 0.254: USB.SHIELD1 48.83,11.24 49.28,11.68 49.28,18.54 48.77,19.05 47.94,19.05 USB.SHIELD2
  Top 0.61: USB.SHIELD2 44.01,19.24 43.69,19.56 C1.1 R1.1
USB1_VBUS  (via drill 0.36)
  Top 0.406: USB.VBUS 48.2,13.15 48.01,12.95 v44.96,12.95
  Top 0.813: FUSE.1 41.15,21.97 41.27,21.84 v41.91,21.84
  Bottom 0.61: v41.91,21.84 45.97,21.84 45.97,17.02 45.47,16.51 44.45,16.51 44.45,12.95 v44.96,12.95
VCC  (via drill 0.36)
  Top 0.178: v29.97,18.29 29.46,18.29
  Top 0.254: U2.1 30.88,11.32 30.48,10.92 v29.72,10.92 | U2.23 31.52,17.51 31.24,17.78 30.48,17.78 v29.97,18.29 | C10.1 13.97,22.86 15.24,22.86 15.49,22.61 15.49,19.56 | 15.49,19.56 15.49,18.54 15.24,18.29 14.14,18.29 R8.2 | R7.2 15.07,19.98 15.49,19.56 | R6.2 R5.2 14.06,8.89 14.99,8.89 15.24,9.14 15.24,11.94 14.82,12.36 C9.1
  Top 0.61: 45.21,6.42 R4.2 R10.2 45.21,8.96 45.21,10.16 v47.5,10.16 | R12.2 R11.2 44.96,21.55 v44.96,20.32 v47.5,20.32 | v17.78,10.92 v17.78,18.29 v17.78,21.34 17.78,22.35 J1.2 | C8.2 29.03,17.85 29.46,18.29 | C7.2 29.72,9.91 v29.72,10.92 | R17.1 v39.12,19.56 | C9.1 12.12,12.36 UART2.3 | UART1.3 10.41,21.59 11.94,23.11 13.8,23.11 C10.1
  Bottom 0.61: v17.78,18.29 v29.97,18.29 39.12,18.29 v39.12,19.56 39.12,20.32 v44.96,20.32 | v29.72,10.92 v17.78,10.92 10.68,10.92 UART2.3 | v47.5,20.32 v47.5,10.16 | UART1.3 17.54,21.57 v17.78,21.34
VCCD1
  Top 0.254: U2.16 35.42,16.18 C6.2
YEL
  Top 0.61: R12.1 PORT1.A

### Text on the board
tPlace: GND | 3V3 | NC | NC | NC | NC | NC | NC | NC | NC | NC | NC | 3V | PORT1 | Grovey / UART | PORT1 | 5V | PORT2 | PORT2 | PORT2 | PWR | GND | GND | 5V0 | TXD | RXD | CTS | RTS | DTR | DSR | DCD | RI | SUSPEND | PORT1
bPlace: GND | 3V3 | NC | NC | NC | NC | NC | NC | NC | NC | NC | NC | PORT1 | GND | VCC | TXD | PatternAgents | RXD | Grovey UART | PORT2 | GND | Rev. 1.0 | Serial Number: | VCC | TXD | RXD | RI | GND | 5V0 | SDA | SCL | TXD | RXD | CTS | RTS | DTR | DSR | DCD